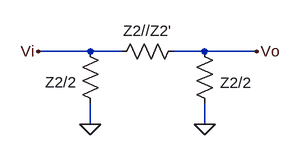
[diagram p0: schematic ej1simplificado.asc]
ej1simplificado.asc, the LTspice schematic file:
Version 4
SHEET 1 880 680
WIRE 112 112 32 112
WIRE 160 112 112 112
WIRE 288 112 240 112
WIRE 368 112 288 112
WIRE 112 224 112 192
WIRE 288 224 288 192
FLAG 112 224 0
FLAG 288 224 0
FLAG 32 112 Vi
FLAG 368 112 Vo
SYMBOL res 256 96 R90
WINDOW 0 0 56 VBottom 2
WINDOW 3 32 56 VTop 2
SYMATTR InstName Z2//Z2'
SYMATTR Value ""
SYMBOL res 128 208 R180
WINDOW 0 37 49 Left 2
WINDOW 3 36 40 Left 2
SYMATTR InstName Z2/2
SYMATTR Value ""
SYMBOL res 272 96 R0
WINDOW 0 40 64 Left 2
SYMATTR InstName Z2/2
SYMATTR Value ""

The netlist it stands for:
* ej1simplificado.asc
R§Z2//Z2' Vo Vi
R§Z2/2 0 Vi
R§Z2/2 Vo 0
.backanno
.end